# EasyEDA Pro project ProPrj_Ecoalerta - Esquemático 1_2026-05-20.epro

# Schematic Ecoalerta - Sistema de Monitoreo
Board Name: Board1; Create Date: 2026-05-19; Page Name: P1; Project Name: Ecoalerta - Esquemático 1; Schematic Name: Ecoalerta - Sistema de Monitoreo; Update Date: 2026-05-20; Company: EasyEDA.com; Drawn: Todos; Page Size: A4; Version: V1.0
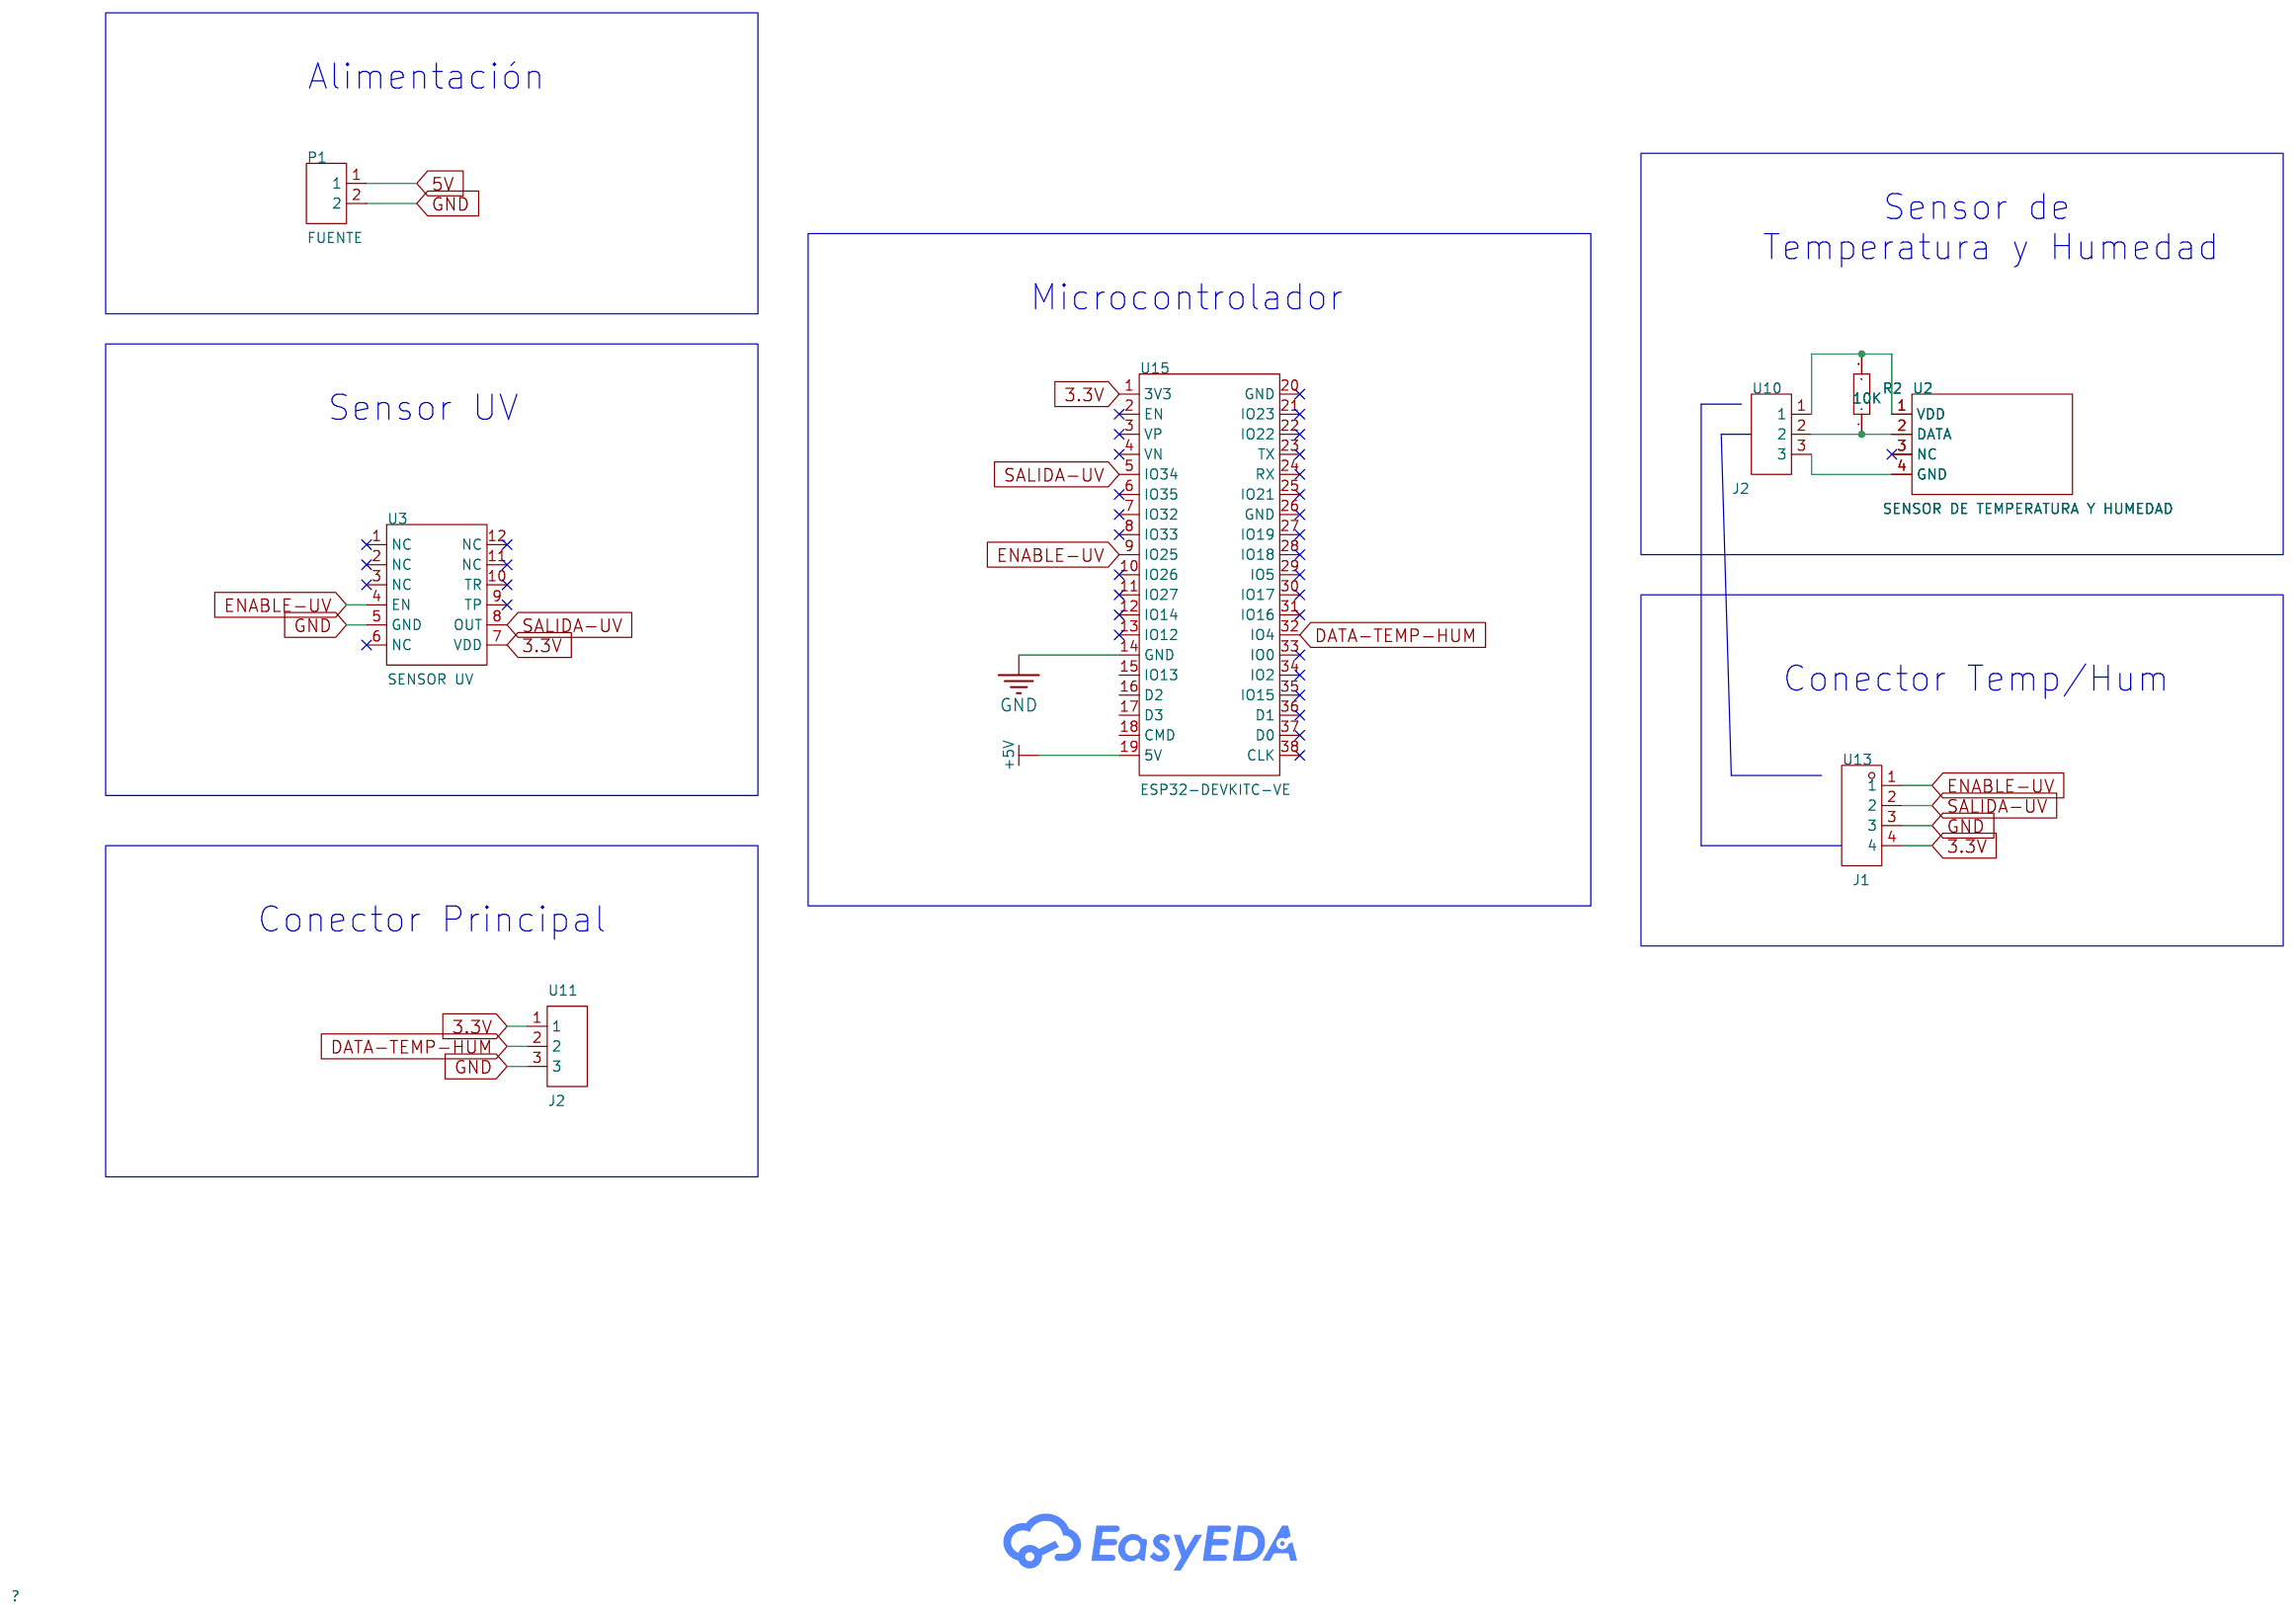
[diagram p0: schematic sheet]

## Parts
P1  FUENTE  [CONN-TH_XY301V-A-5.0-2P]
R2  10K  [R0603]
U2  SENSOR DE TEMPERATURA Y HUMEDAD  [SENSOR-TH_DHT11]
U3  SENSOR UV  [DFN-12_L3.0-W3.0-P0.45-BL-EP2.5]
U10  J2  [CONN-TH_3P-P5.08_2EDG-5.08-3AW]
U11  J2  [CONN-TH_3P-P5.08_2EDG-5.08-3AW]
U13  J1  [TH-4P_L11.7-W9.3_C9900032758]
U15  ESP32-DEVKITC-VE  [BULETM-SMD_ESP32-DEVKITC]

## Library data of the parts
P1 = KF301-2P接线端子: Supplier Part: C9900016950; Supplier Footprint: CK301-2P; JLCPCB Part Class: Extended Part; Supplier: LCSC
R2 = Res_0603: Supplier Footprint: 0603
U2 = DHT11_C117051: Temperature Range:-20℃~+60℃ Temperature Range:-20℃~+60℃ Humidity:5%RH~95%RH Humidity:5%RH~95%RH Voltage - Supply:3.3V~5.5V Voltage - Supply:3.3V~5.5V Current - Supply:1mA Humidity Tolerance:±5%RH Humidity Tolerance:±5%RH Temperature Tolerance:±2℃ Temperat; LCSC Part Name: 新款电容式数字温湿度传感器,老款已停产16.1x12.6x5.8mm DHT11  电容式传感器; Supplier Part: C117051; Manufacturer: 广州奥松; Supplier Footprint: SIP-4; JLCPCB Part Class: Extended Part; Datasheet: https://item.szlcsc.com/datasheet/DHT11/118309.html; Supplier: LCSC; Temperature Range: -20℃~+60℃; Humidity: 5%RH~95%RH; Voltage - Supply: 3.3V~5.5V; Current - Supply: 1mA; Humidity Tolerance: ±5%RH; Temperature Tolerance: ±2℃
U3 = ML8511-00FCZ05B: Measurement Type:Light Intensity Voltage - Supply:2.7V~3.6V Voltage - Supply:2.7V~3.6V Operating Temperature:-20℃~+70℃ Operating Temperature:-20℃~+70℃; Supplier Part: C6989818; Manufacturer: ROHM(罗姆); Supplier Footprint: SMD-12P; JLCPCB Part Class: Extended Part; Datasheet: https://item.szlcsc.com/datasheet/ML8511-00FCZ05B/7955778.html; Supplier: LCSC; Measurement Type: Light Intensity; Voltage - Supply: 2.7V~3.6V; Operating Temperature: -20℃~+70℃
U10 U11 = Terminal block KF2EDGK-5.08mm 3Pin: Supplier Part: C9900263183; JLCPCB Part Class: Extended Part; Supplier: LCSC
U13 = PE_GND_Terminal: Supplier Part: C9900032758; Supplier Footprint: TH-4P; JLCPCB Part Class: Extended Part; Supplier: LCSC
U15 = ESP32-DEVKITC-VE: LCSC Part Name: 不带固件; Supplier Part: C20437001; Manufacturer: ESPRESSIF(乐鑫); JLCPCB Part Class: Extended Part; Datasheet: https://item.szlcsc.com/datasheet/ESP32-DEVKITC-VE/21775466.html; Supplier: LCSC

## Nets
3.3V: U3.7(VDD) U11.1 U13.4 U15.1(3V3)
5V: P1.1
+5V: U15.19(5V)
GND: P1.2 U3.5(GND) U11.3 U13.3 U15.14(GND)
DATA-TEMP-HUM: U11.2 U15.32(IO4)
ENABLE-UV: U3.4(EN) U13.1 U15.9(IO25)
SALIDA-UV: U3.8(OUT) U13.2 U15.5(IO34)
$1N5466: U2.4(GND) U10.3
$1N5470: R2.1 U2.2(DATA) U10.2
$1N5482: R2.2 U2.1(VDD) U10.1

Not connected (* = marked no-connect by the designer): U2 3(NC)*; U3 1(NC)* 2(NC)* 3(NC)* 6(NC)* 9(TP)* 10(TR)* 11(NC)* 12(NC)*; U15 2(EN)* 3(VP)* 4(VN)* 6(IO35)* 7(IO32)* 8(IO33)* 10(IO26)* 11(IO27)* 12(IO14)* 13(IO12)* 15(IO13) 16(D2) 17(D3) 18(CMD) 20(GND)* 21(IO23)* 22(IO22)* 23(TX)* 24(RX)* 25(IO21)* 26(GND)* 27(IO19)* 28(IO18)* 29(IO5)* 30(IO17)* 31(IO16)* 33(IO0)* 34(IO2)* 35(IO15)* 36(D1)* 37(D0)* 38(CLK)*

## Notes on the sheet
- Alimentación
- Sensor de
- Temperatura y Humedad
- Microcontrolador
- Sensor UV
- Conector Temp/Hum
- Conector Principal

# Board PCB1
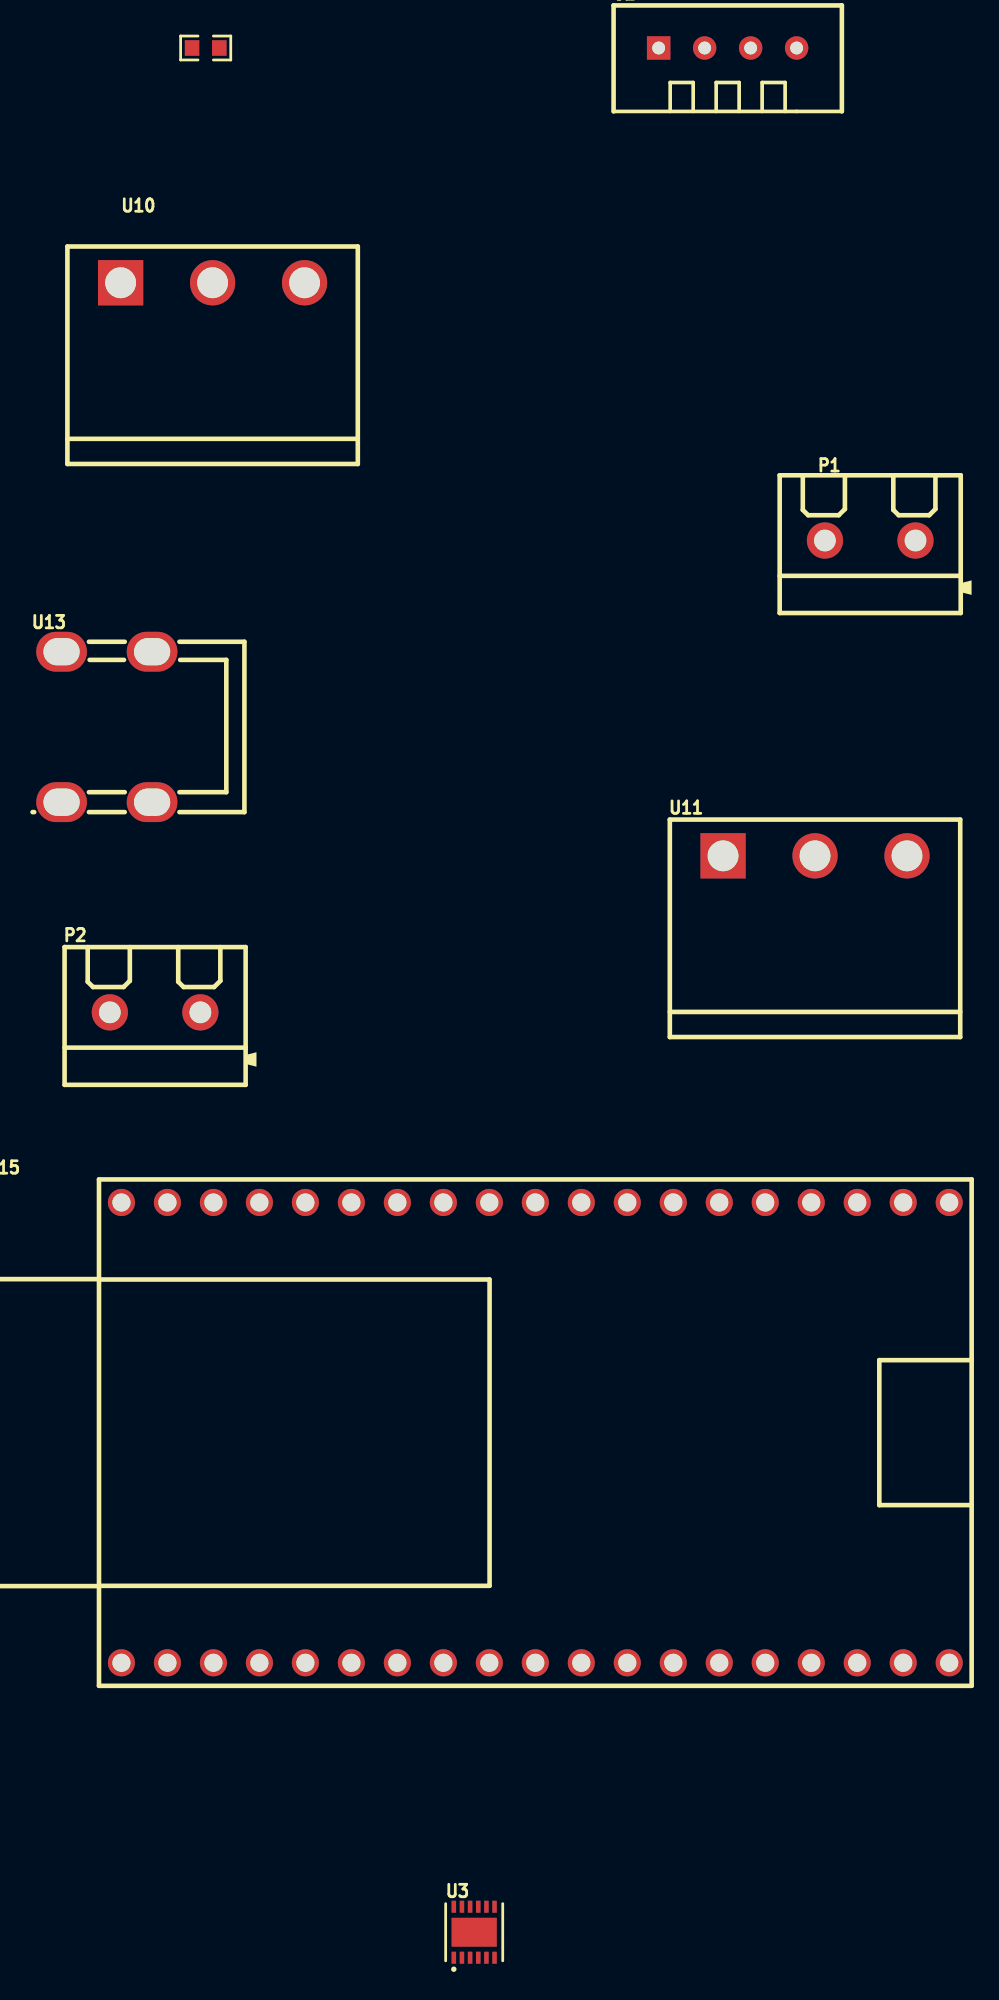
[diagram p1: board, top side]
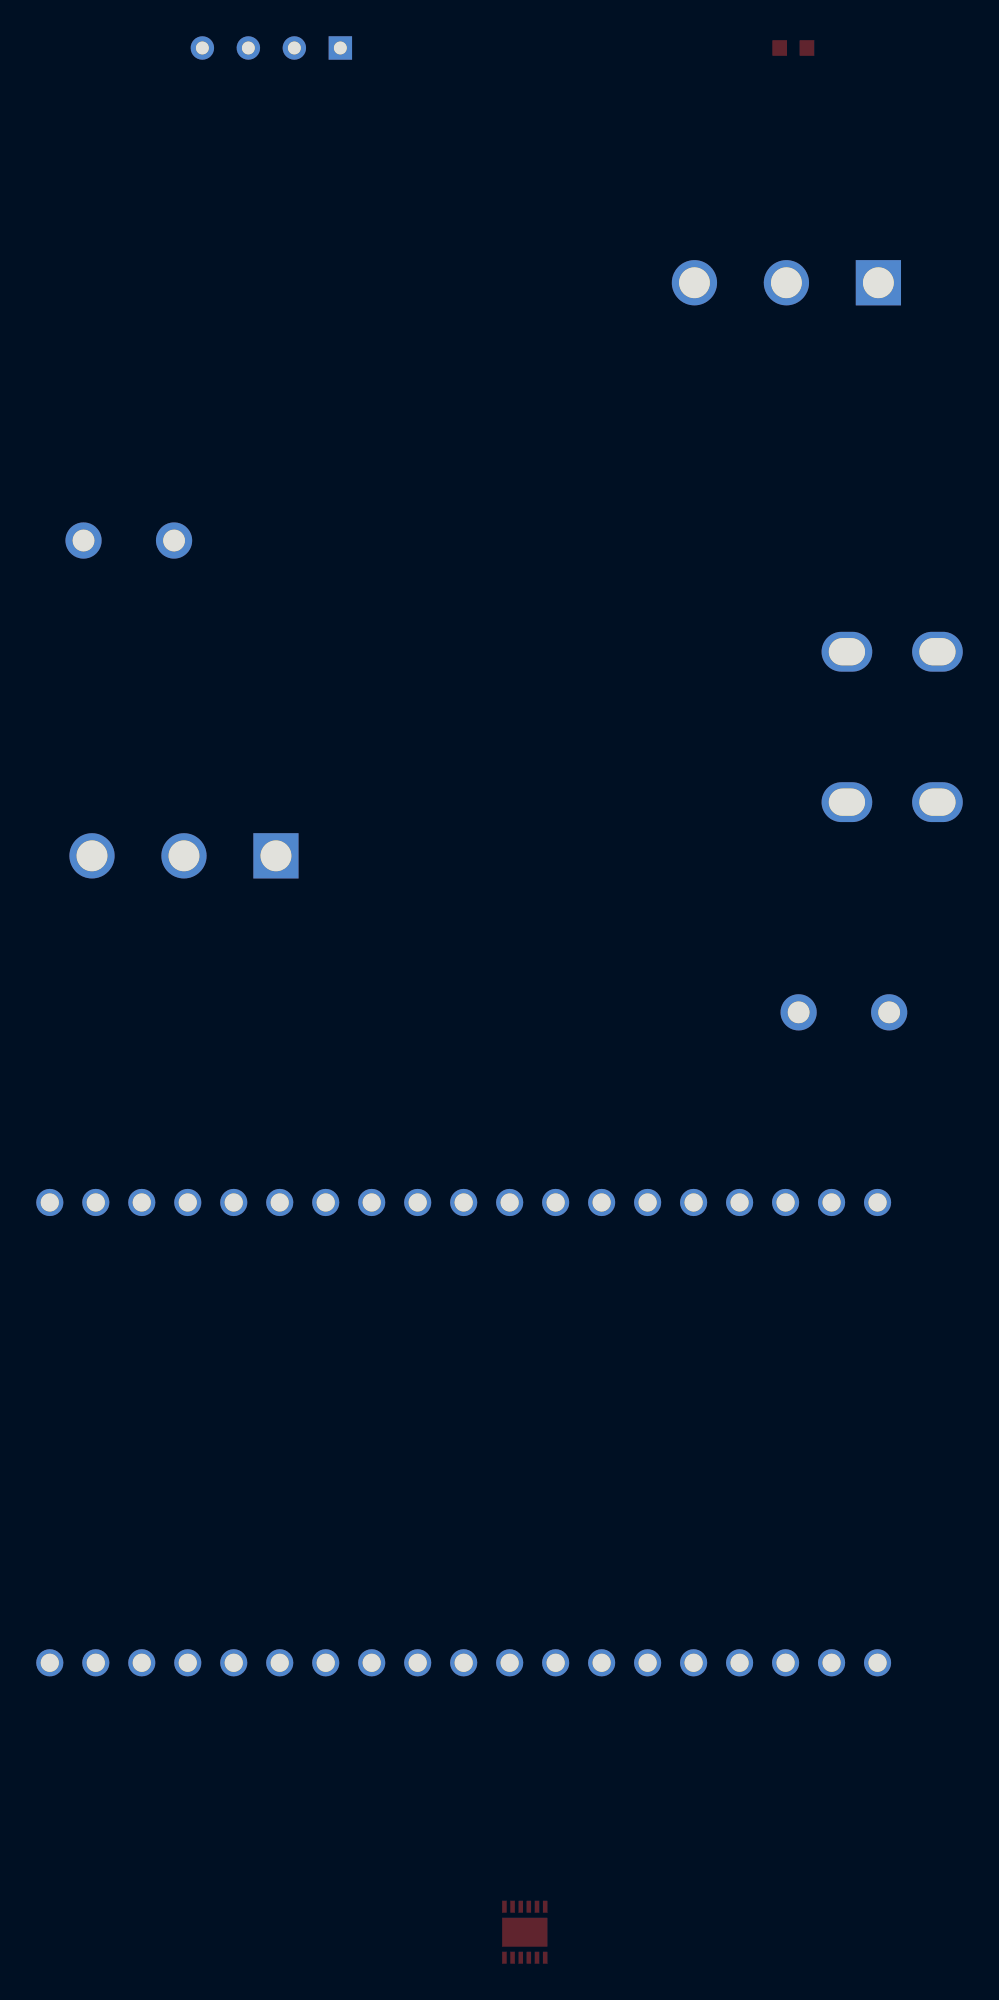
[diagram p2: board, bottom side, seen from below]

No outline. copper layers: Top Layer, Bottom Layer. Coordinates in mm from the lowest, leftmost part position.
Stack: Top Layer 0.035mm / Dielectric1 1.51mm FR4 er 4.5 / Bottom Layer 0.035mm

## Design rules (mm)
template: JLCPCB Capability(Two Layers Board)
spacing copperThickness1oz (default): track to track 0.102, other pairs 0.152 to 0.3
spacing copperThickness2oz: track to track 0.203, other pairs 0.152 to 0.3
track width copperThickness1oz (default): min 0.127, default 0.254, max 2.54
track width copperThickness2oz: min 0.203, default 0.254, max 2.54
differential pair differentialPair (default): width min 0.127, default 0.254, max 2.54; gap min 0.152, default 0.152
via viaSize (default): diameter min 0.5, default 0.61, max 10; hole min 0.3, default 0.305, max 6.3

## Placement (name value [footprint] x y rotation side)
P1  FUENTE  [CONN-TH_XY301V-A-5.0-2P]  42.16 76.79 0 top
P2  FUENTE  [CONN-TH_XY301V-A-5.0-2P]  2.67 50.76 0 top
R2  10K  [R0603]  5.46 103.97 0 top
U2  SENSOR DE TEMPERATURA Y HUMEDAD  [SENSOR-TH_DHT11]  34.29 103.97 0 top
U3  SENSOR UV  [DFN-12_L3.0-W3.0-P0.45-BL-EP2.5]  20.29 0 0 top
U10  J2  [CONN-TH_3P-P5.08_2EDG-5.08-3AW]  5.84 91.02 0 top
U11  J2  [CONN-TH_3P-P5.08_2EDG-5.08-3AW]  39.12 59.4 0 top
U13  J1  [TH-4P_L11.7-W9.3_C9900032758]  0 66.51 0 top
U15  ESP32-DEVKITC-VE  [BULETM-SMD_ESP32-DEVKITC]  23.67 27.57 0 top

## Footprints (pads in the part's own frame, mm; a bottom-side part is the same pattern mirrored in y, then rotated)
BULETM-SMD_ESP32-DEVKITC
  round 1.5 hole 1: 1(-22.86,-12.7) 2(-20.32,-12.7) 3(-17.78,-12.7) 4(-15.24,-12.7) 5(-12.7,-12.7) 6(-10.16,-12.7) 7(-7.62,-12.7) 8(-5.08,-12.7) 9(-2.54,-12.7) 10(0,-12.7) 11(2.54,-12.7) 12(5.08,-12.7) 13(7.62,-12.7) 14(10.16,-12.7) 15(12.7,-12.7) 16(15.24,-12.7) 17(17.78,-12.7) 18(20.32,-12.7) 19(22.86,-12.7) 20(-22.86,12.7) 21(-20.32,12.7) 22(-17.78,12.7) 23(-15.24,12.7) 24(-12.7,12.7) 25(-10.16,12.7) 26(-7.62,12.7) 27(-5.08,12.7) 28(-2.54,12.7) 29(0,12.7) 30(2.54,12.7) 31(5.08,12.7) 32(7.62,12.7) 33(10.16,12.7) 34(12.7,12.7) 35(15.24,12.7) 36(17.78,12.7) 37(20.32,12.7) 38(22.86,12.7)
CONN-TH_3P-P5.08_2EDG-5.08-3AW
  rect 2.5x2.5 hole 1.7: 1(-5.08,0)
  round 2.5 hole 1.7: 2(0,0) 3(5.08,0)
CONN-TH_XY301V-A-5.0-2P
  round 2 hole 1.2: 1(-2.5,0) 2(2.5,0)
DFN-12_L3.0-W3.0-P0.45-BL-EP2.5
  rect 0.252x0.665 smd: 1(-1.125,-1.407) 2(-0.675,-1.407) 3(-0.225,-1.407) 4(0.225,-1.407) 5(0.675,-1.407) 6(1.125,-1.407) 7(1.125,1.407) 8(0.675,1.407) 9(0.225,1.407) 10(-0.225,1.407) 11(-0.675,1.407) 12(-1.125,1.407)
  rect 2.5x1.6 smd: 13(0,0)
R0603
  rect 0.806x0.864 smd: 1(-0.753,0) 2(0.753,0)
SENSOR-TH_DHT11
  rect 1.296x1.296 hole 0.711: 1(-3.81,0)
  round 1.296 hole 0.711: 2(-1.27,0) 3(1.27,0) 4(3.81,0)
TH-4P_L11.7-W9.3_C9900032758
  oval 2.8x2.2 hole 2x1.5: 1(-2.5,-4.15) 2(2.5,-4.15) 3(2.5,4.15) 4(-2.5,4.15)

## Nets
3.3V: U3.7 U11.1 U13.4 U15.1
5V: P1.1 U15.19
+5V: P2.1
GND: P1.2 P2.2 U3.5 U11.3 U13.3 U15.14
DATA-TEMP-HUM: U11.2 U15.32
ENABLE-UV: U3.4 U13.1 U15.9
SALIDA-UV: U3.8 U13.2 U15.5
$1N5466: U2.4 U10.3
$1N5470: R2.1 U2.2 U10.2
$1N5482: R2.2 U2.1 U10.1

Pads without a net: U2 3; U3 1 2 3 6 9 10 11 12 13; U15 2 3 4 6 7 8 10 11 12 13 15 16 17 18 20 21 22 23 24 25 26 27 28 29 30 31 33 34 35 36 37 38
